# Altium schematic sheet LEDs.SchDoc
size A; SheetNumber: 4; SheetTotal: 4
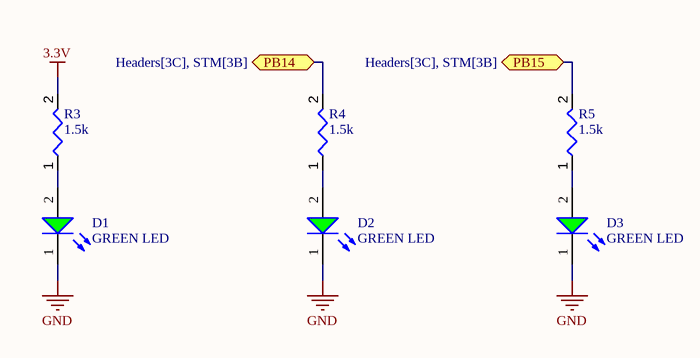
[diagram p0: LEDs.SchDoc]

## Parts
D1  GREEN LED  [WL-SMCW_0603_150060xx75000]
D2  GREEN LED  [WL-SMCW_0603_150060xx75000]
D3  GREEN LED  [WL-SMCW_0603_150060xx75000]
R3  value 1.5k  [RES_0603]  (hidden comment: RES 1.5k)
R4  value 1.5k  [RES_0603]  (hidden comment: RES 1.5k)
R5  value 1.5k  [RES_0603]  (hidden comment: RES 1.5k)

## Ports
PB14 (bidir, see Headers[3C], STM[3B]), PB15 (bidir, see Headers[3C], STM[3B])

## Nets
3.3V: R3.2
GND: D1.1(K) D2.1(K) D3.1(K)
PB14: R4.2 ; port PB14
PB15: R5.2 ; port PB15
NetD1_2: D1.2(A) R3.1
NetD2_2: D2.2(A) R4.1
NetD3_2: D3.2(A) R5.1

## Library data of the parts
D1-D3 = CMP-004-00006-2: Single Color LED, Green, Water Clear, 1.1mm; Forward Current: 30mA; Min Operating Temperature: -40°C; Max Operating Temperature: 85°C; Component Type: Standard; RoHS Compliant: Yes; Mounting Technology: Surface Mount; Source: Integrated_Library - 04.08.25 - 13.21.SchLib; Pins: 2; Design Item ID: GREEN LED
R3-R5 = CMP-009-00797-1: Resistor 1.5k 5% 100 mW 0603; Power: 100mW; Source: Generic_Schematic_Library.SchLib; Design Item ID: RES 1.5k; Tolerance: 5%